# EAGLE design CrackberryPi_1.0.6.2_random3 (EAGLE 7.2.0)
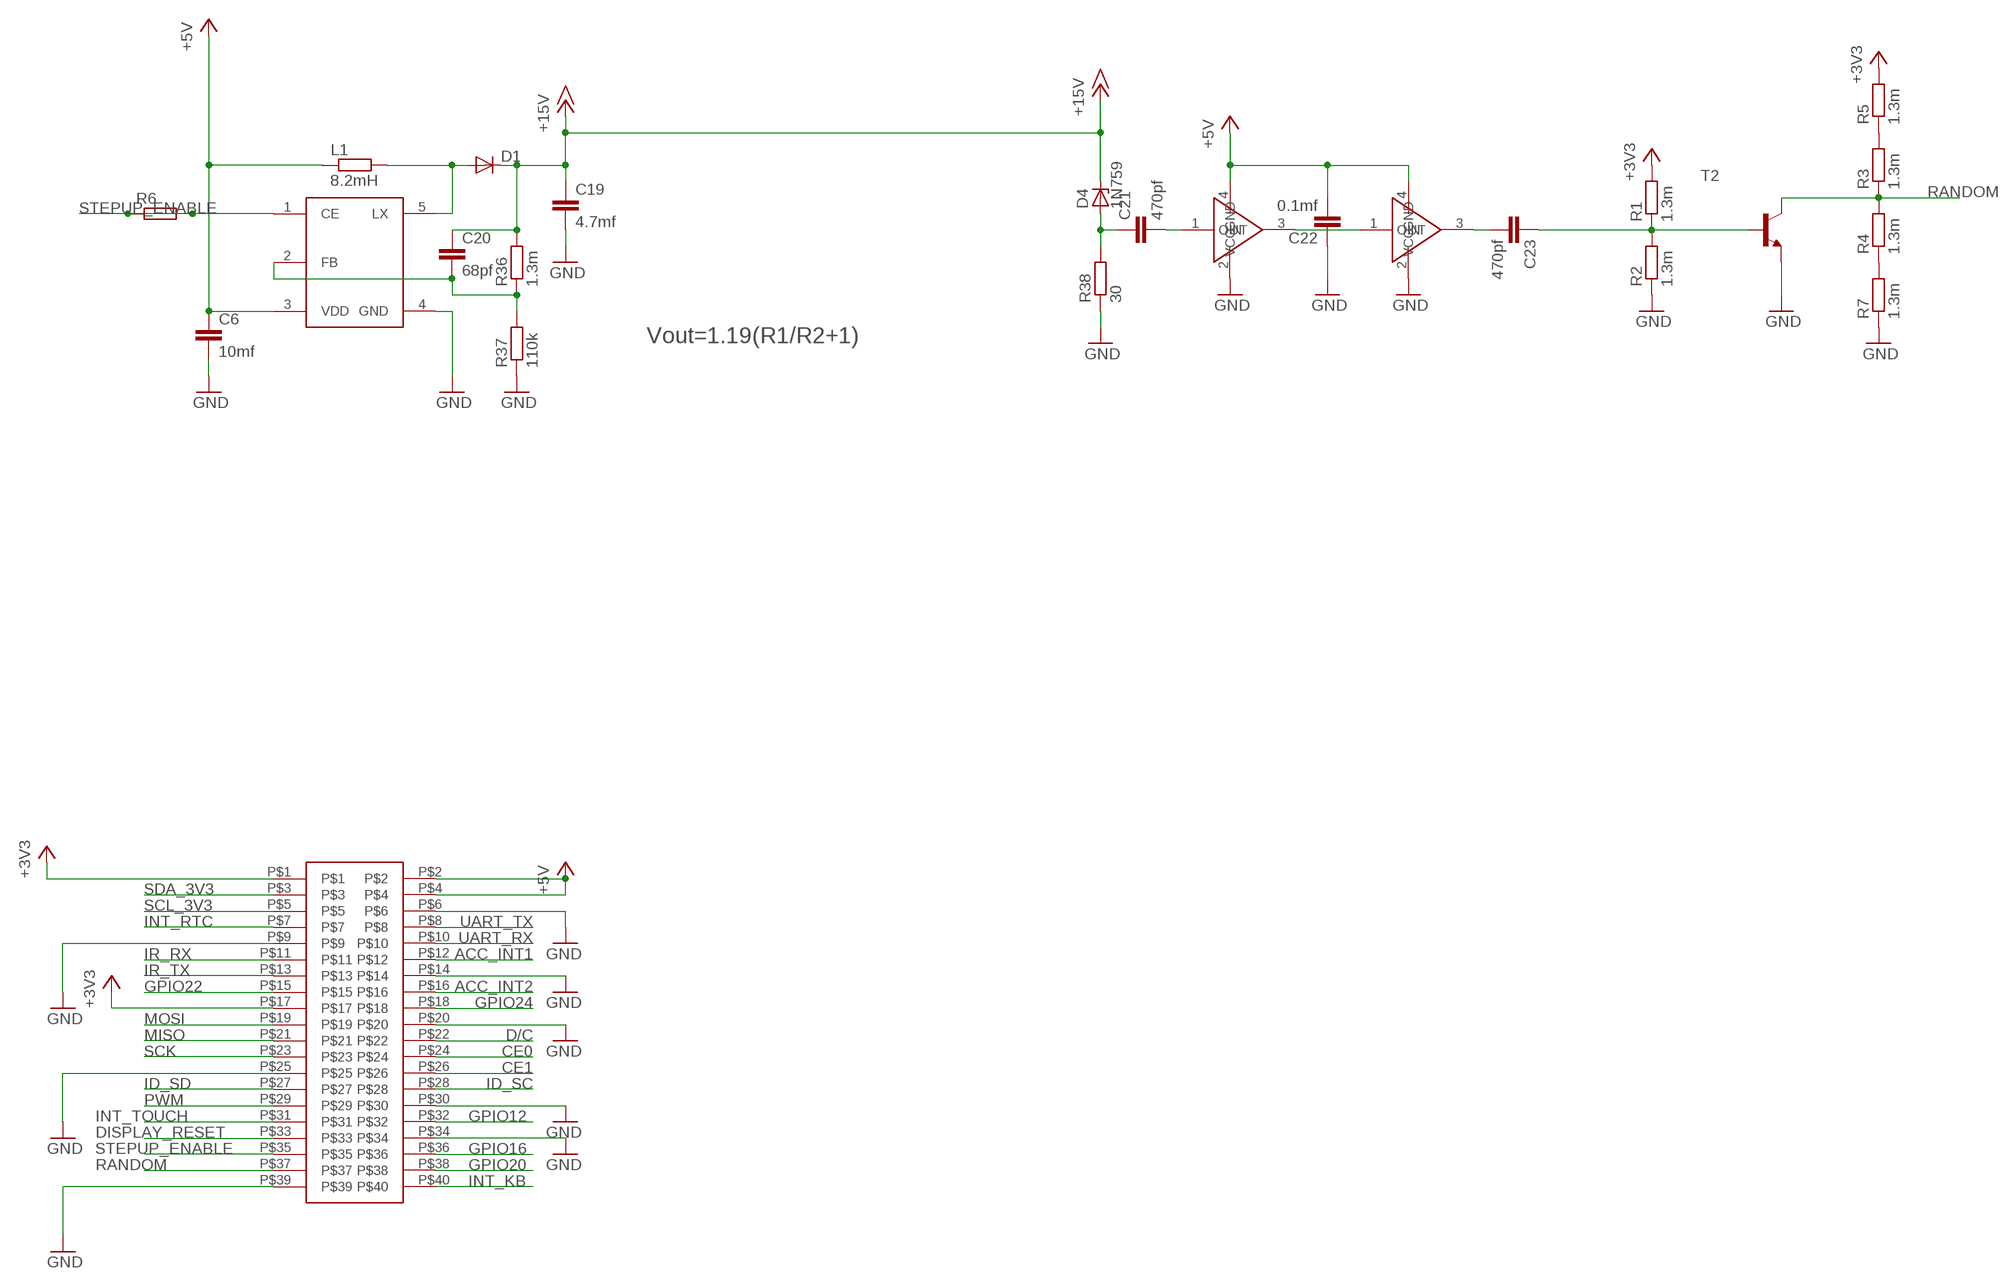
[diagram p0: schematic, sheet 1]

## Parts
C6  10mf  C-EUC0603  [C0603]
C19  4.7mf  C-EUC0603  [C0603]
C20  68pf  C-EUC0603  [C0603]
C21  470pf  C-EUC0603  [C0603]
C22  0.1mf  C-EUC0603  [C0603]
C23  470pf  C-EUC0603  [C0603]
D1  DIODE-SOD123  [SOD123]
D4  1N759  ZENER-DIODESOD80C  [SOD80C]
L1  8.2mH  R-EU_R1210  [R1210]
R1  1.3m  R-EU_R0603  [R0603]
R2  1.3m  R-EU_R0603  [R0603]
R3  1.3m  R-EU_R0603  [R0603]
R4  1.3m  R-EU_R0603  [R0603]
R5  1.3m  R-EU_R0603  [R0603]
R6  R-EU_R1210  [R1210]
R7  1.3m  R-EU_R0603  [R0603]
R36  1.3m  R-EU_R0603  [R0603]
R37  110k  R-EU_R0603  [R0603]
R38  30  R-EU_R0603  [R0603]
T2  -NPN-SOT23-EBC  [SOT23-EBC]
U$2  NCP1406  [SOT23-5L]
U$3  MAX2650  [SOT143-W]
U$10  MAX2650  [SOT143-W]
U$11  HEADER  [20X2]

## Nets
+3V3: R1.2 R5.2 U$11.P$1 U$11.P$17
+5V: C6.1 C22.2 L1.1 U$2.3(VDD) U$3.4(VCC) U$10.4(VCC) U$11.P$2 U$11.P$4
+15V: C19.1 C20.1 D1.C D4.C R36.2
ACC_INT1: U$11.P$12
ACC_INT2: U$11.P$16
CE0: U$11.P$24
CE1: U$11.P$26
D/C: U$11.P$22
DISPLAY_RESET: U$11.P$33
FB: C20.2 R36.1 R37.2 U$2.2(FB)
GND: C6.2 C19.2 C22.1 R2.1 R7.1 R37.1 R38.1 T2.E U$2.4(GND) U$3.2(GND) U$10.2(GND) U$11.P$6 U$11.P$9 U$11.P$14 U$11.P$20 U$11.P$25 U$11.P$30 U$11.P$34 U$11.P$39
GPIO12: U$11.P$32
GPIO16: U$11.P$36
GPIO20: U$11.P$38
GPIO22: U$11.P$15
GPIO24: U$11.P$18
ID_SC: U$11.P$28
ID_SD: U$11.P$27
IN_1: C21.2 U$3.1(IN)
INT_KB: U$11.P$40
INT_RTC: U$11.P$7
INT_TOUCH: U$11.P$31
IR_RX: U$11.P$11
IR_TX: U$11.P$13
LX: D1.A L1.2 U$2.5(LX)
MISO: U$11.P$21
MOSI: U$11.P$19
N$2: C23.1 R1.1 R2.2 T2.B
N$3: R3.2 R5.1
N$4: R4.1 R7.2
N$16: C21.1 D4.A R38.2
OUT1_IN2: U$3.3(OUT) U$10.1(IN)
OUT2: C23.2 U$10.3(OUT)
PWM: U$11.P$29
RANDOM: R3.1 R4.2 T2.C U$11.P$37
SCK: U$11.P$23
SCL_3V3: U$11.P$5
SDA_3V3: U$11.P$3
STEPUP_ENABLE: R6.1 R6.2 U$2.1(CE) U$11.P$35
UART_RX: U$11.P$10
UART_TX: U$11.P$8

## Notes on the sheet
- Vout=1.19(R1/R2+1)

## Library data of the parts
C6 C19-C23 = rcl:C-EU: CAPACITOR, European symbol
D1 = diode:DIODE-: DIODE
D4 = diode:ZENER-DIODE: Z-Diode
L1 R1-R7 R36-R38 = rcl:R-EU_: RESISTOR, European symbol
T2 = transistor:*-NPN-: NPN Transistror BF959 corrected 2008.03.06
U$2 = ncp1406:NCP1406
U$3 U$10 = max2650:MAX2650
U$11 = 20x2_cirqoid:HEADER

## Board
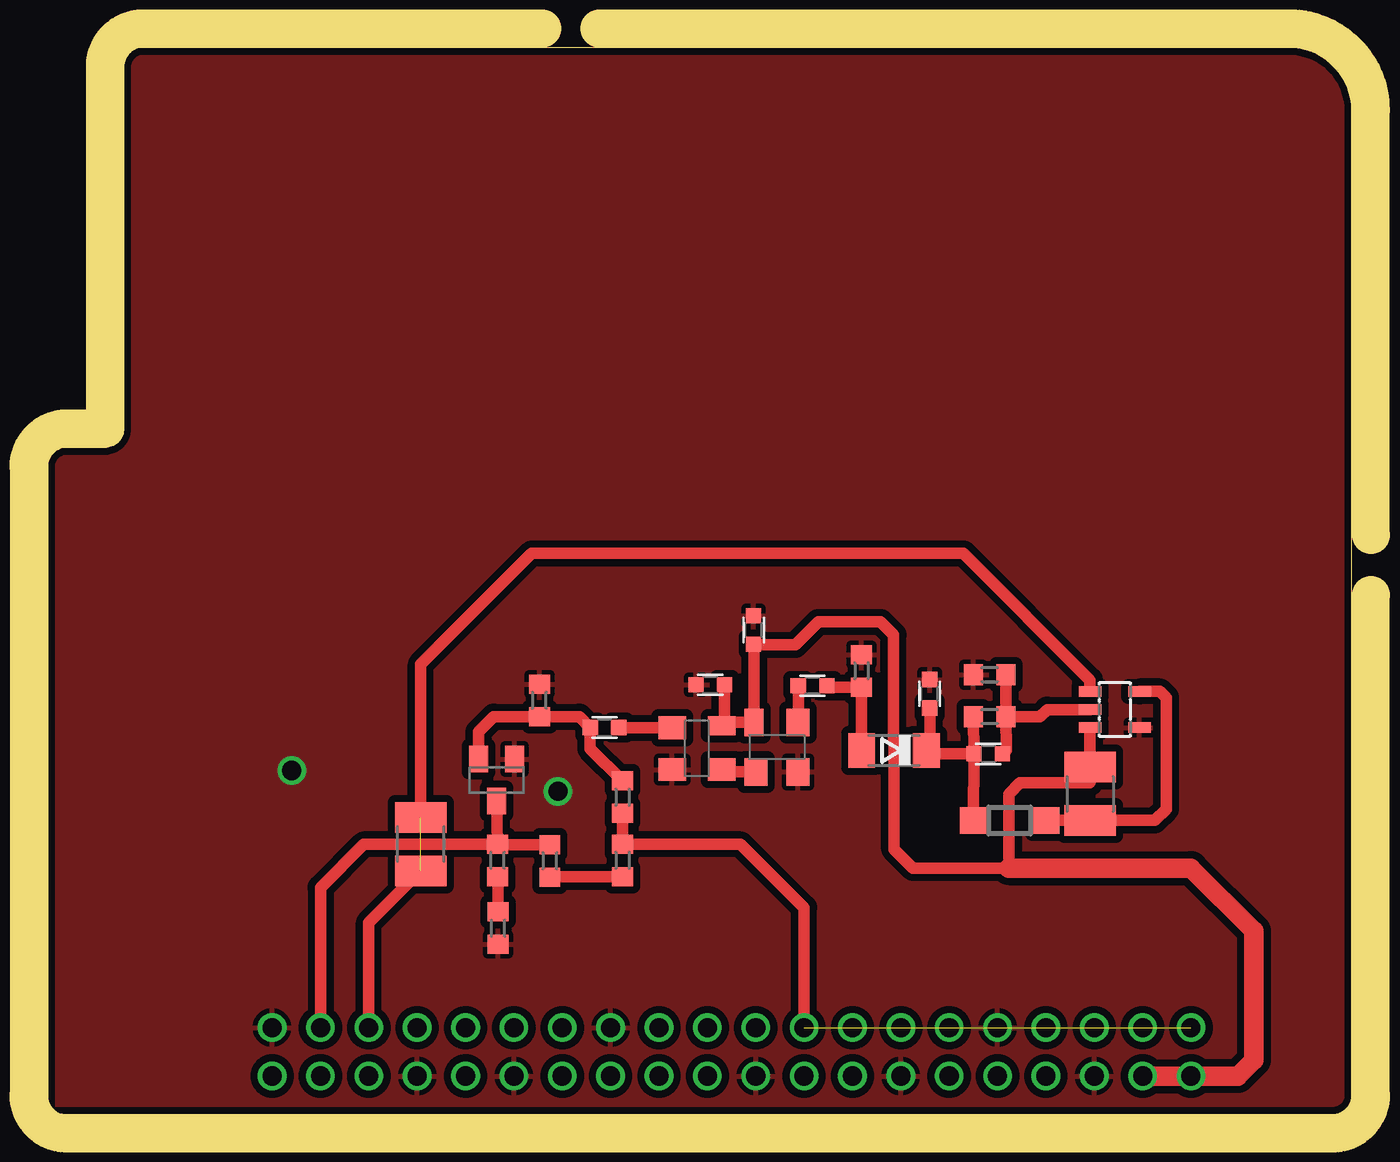
[diagram p1: board, top side]
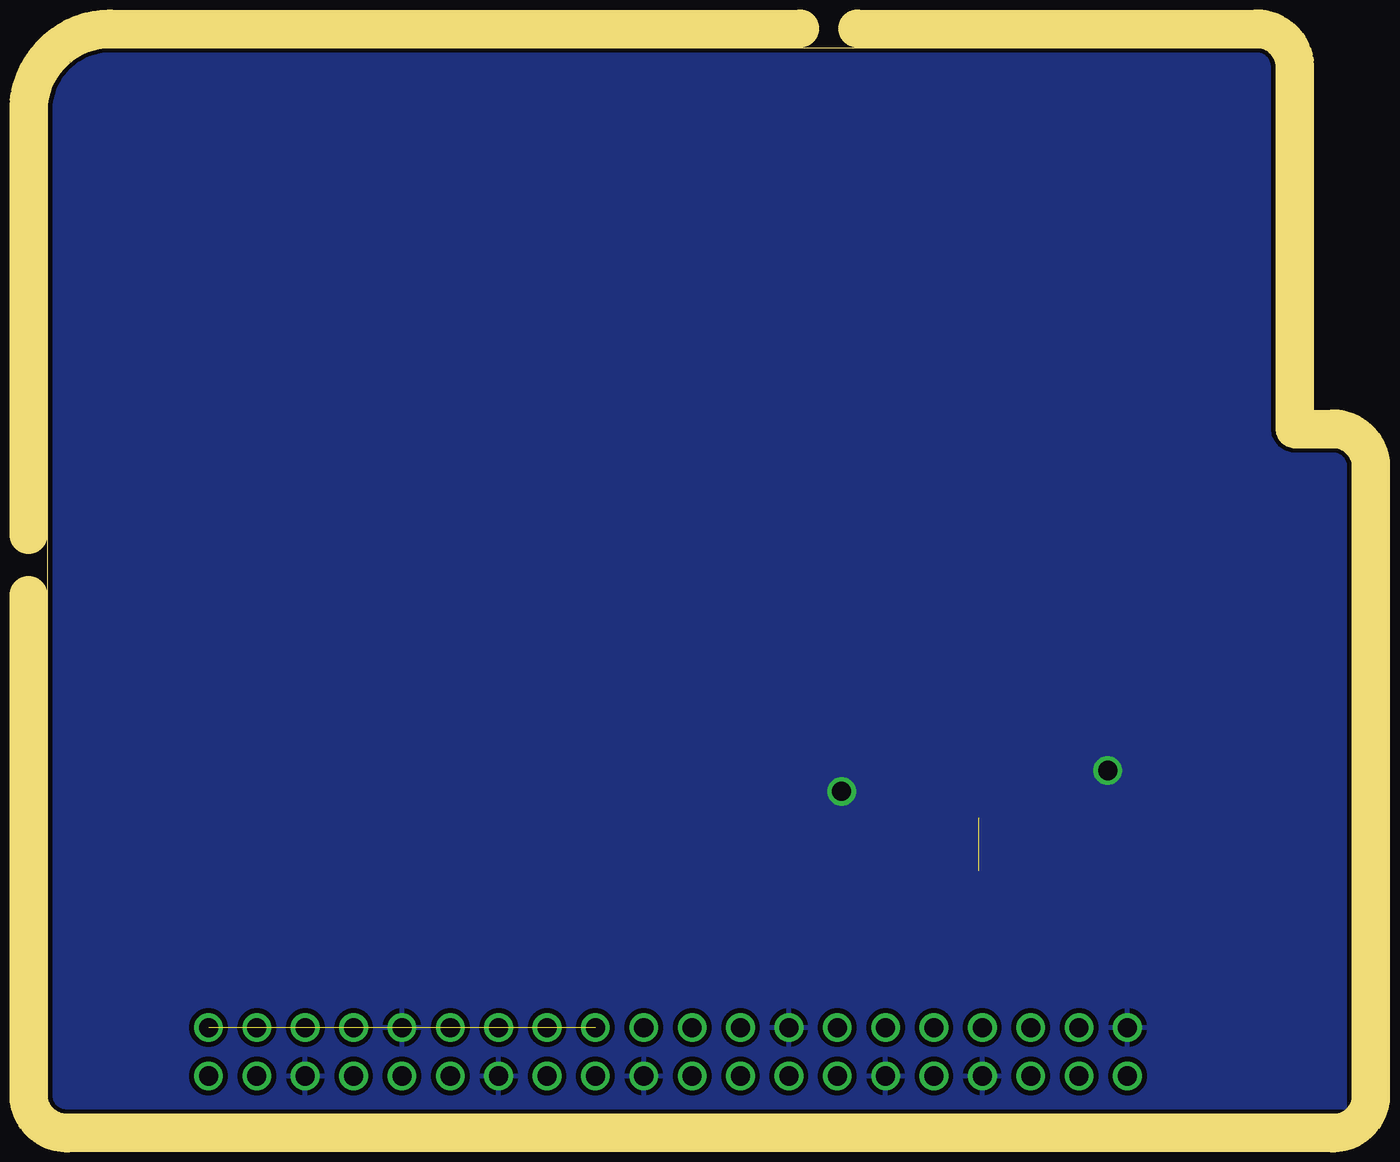
[diagram p2: board, bottom side, seen from below]

Size 68.5 x 56 mm. Coordinates in mm from the lower left corner, seen from the top.
Outline: 0,34 0,0 67.5,0 arc90 68.5,1 68.5,52.7 arc90 65.2,56 5,56 arc90 4,55 4,36 arc-90 3,35 1,35 arc90 0,34
Copper layers (1*16): Top 0.035mm / dielectric 1.5mm / Bottom 0.035mm
Design rules "SeeedStudio_2layer_DRU_no_angle_20140221": minimum track width 6mil, minimum drill 12mil, track to track 6mil, track to pad 6mil, pad to pad 6mil, via to via 6mil, smd to smd 0mil, copper to edge 10mil, drill to drill 10mil, minimum pad ring 10mil, minimum via ring 6mil, stop-mask expansion 2mil, vias tented up to drill 100mil, thermal gap 10mil
Milling: 13 lines

### Footprints (pad centres in the part's own frame; a part is rotated, then mirrored left to right if it is on the bottom)
C0603 = smd 0.8 x 0.8: 1 -0.75,0; 2 0.75,0
SOD123 = smd 1.4 x 1.4: A 1.9,0; C -1.9,0
SOD80C = smd 1.4 x 1.8: A 1.7,0; C -1.7,0
R1210 = smd 1.6 x 2.7: 1 -1.4,0; 2 1.4,0
R0603 = smd 1 x 1.1: 1 -0.85,0; 2 0.85,0
SOT23-EBC = smd 1 x 1.4: B 0.95,-1.1; C 0,1.1; E -0.95,-1.1
SOT23-5L = smd 0.55 x 1.2: 1 -0.95,-1.3; 2 0,-1.3; 3 0.95,-1.3; 4 0.95,1.3; 5 -0.95,1.3
SOT143-W = smd 1.2 x 1.45: 1 -1.1,-1.3; 2 -1.1,1.3; 3 1.1,1.3 | smd 1 x 1.45: 4 1.2,-1.3
20X2 = drill 1: P$1 0,0; P$2 0,2.54; P$3 2.54,0; P$4 2.54,2.54; P$5 5.08,0; P$6 5.08,2.54; P$7 7.62,0; P$8 7.62,2.54; P$9 10.16,0; P$10 10.16,2.54; P$11 12.7,0; P$12 12.7,2.54; P$13 15.24,0; P$14 15.24,2.54; P$15 17.78,0; P$16 17.78,2.54; P$17 20.32,0; P$18 20.32,2.54; P$19 22.86,0; P$20 22.86,2.54; P$21 25.4,0; P$22 25.4,2.54; P$23 27.94,0; P$24 27.94,2.54; P$25 30.48,0; P$26 30.48,2.54; P$27 33.02,0; P$28 33.02,2.54; P$29 35.56,0; P$30 35.56,2.54; P$31 38.1,0; P$32 38.1,2.54; P$33 40.64,0; P$34 40.64,2.54; P$35 43.18,0; P$36 43.18,2.54; P$37 45.72,0; P$38 45.72,2.54; P$39 48.26,0; P$40 48.26,2.54

### Placement (x,y rotation side)
C6  37.08,25.43 90 top
C19  46.33,22.07 90 top
C20  49.4,18.93 0 top
C21  40.17,22.5 180 top
C22  34.8,22.55 0 top
C23  29.25,20.3 0 top
D1  50.52,15.43 0 top
D4  44.45,19.1 180 top
L1  54.75,16.82 270 top
R1  30.2,16.65 270 top
R2  25.82,21.73 270 top
R3  26.38,13.3 270 top
R4  23.62,13.32 90 top
R5  30.2,13.32 90 top
R6  19.6,14.18 90 top
R7  23.65,9.78 90 top
R36  49.48,20.88 180 top
R37  49.48,23.07 0 top
R38  42.75,23.27 270 top
T2  23.57,17.55 180 top
U$2  56.05,21.25 270 top
U$3  38.3,19.27 180 top
U$10  34.1,19.2 90 top
U$11  60.05,4.55 180 top

### Tracks (layer width: path | path; a pad name or v marks a point on that pad's centre or on a via)
+3V3  (1 unrouted)
  Top 0.61: R1.2 R5.2 36.4,14.18 39.73,10.85 U$11.P$17
+5V
  Top 0.61: L1.1 U$2.3 54.75,17.4 51.08,17.4 50.48,16.8 50.48,12.93 45.45,12.93 44.45,13.93 44.43,25.18 43.75,25.85 40.48,25.85 39.27,24.65 37.1,24.65 | 35.55,20.57 U$3.4 37.1,24.65 | 35.55,20.57 U$10.4 | 35.55,20.57 C22.2 35.5,22.32 | C6.1 37.1,24.65
  Top 1.016: U$11.P$4 U$11.P$2 62.51,2.01 63.35,2.85 63.35,9.62 60.05,12.93 50.48,12.93
+15V
  Top 0.61: D1.C C20.1 | C20.1 R36.2 | 46.33,18.93 C20.1 | 46.33,18.93 D4.C | 46.33,18.93 C19.1
FB
  Top 0.61: C20.2 50.35,19.12 R36.1 | U$2.2 52.5,21.25 52.12,20.88 R36.1 | R36.1 R37.2
GND  (via drill 1)
  other vias: 12.82,18.05 26.8,16.95
  pour Top (isolate 0.38, rank 6): 0,34 0,1 arc90 1,0 67.5,0 arc90 68.62,1.13 68.62,52.83 arc90 65.1,56 5,56 arc90 4,55 4,36 arc-90 3,35 1,35 arc90
  pour Bottom (isolate 0.254): 0,34.95 0,1 arc90 1,0 67.5,0 arc90 68.53,1.03 68.53,52.82 arc90 65.4,55.95 4.03,55.95 4.03,34.95
IN_1
  Top 0.61: U$3.1 39.42,20.6 C21.2
LX
  Top 0.61: D1.A L1.2 58.15,15.43 58.75,16.02 58.75,21.88 58.42,22.2 U$2.5
N$2
  Top 0.61: R1.1 28.5,19.2 C23.1 27.93,20.88 R2.2 23.43,20.88 22.62,20.07 T2.B
N$3
  Top 0.61: R3.2 26.4,12.47 R5.1
N$4
  Top 0.61: R4.1 23.65,12.45 R7.2
N$16
  Top 0.61: D4.A R38.2 41,22.43 C21.1
OUT1_IN2
  Top 0.61: U$10.1 35.4,17.98 U$3.3
OUT2
  Top 0.61: C23.2 U$10.3
RANDOM
  Top 0.61: R3.1 23.65,14.15 R4.2 | R4.2 T2.C | R4.2 16.6,14.18 14.33,11.9 U$11.P$37
STEPUP_ENABLE  (1 unrouted)
  Top 0.61: U$2.1 54.75,22.8 48.1,29.45 25.43,29.45 19.6,23.62 R6.2 | U$11.P$35 16.87,10.04 R6.1